# EAGLE design rapidshark-main-breakout-top-mk-1.8 (EAGLE 6.5.0)
AUTHOR: sean@yak.net
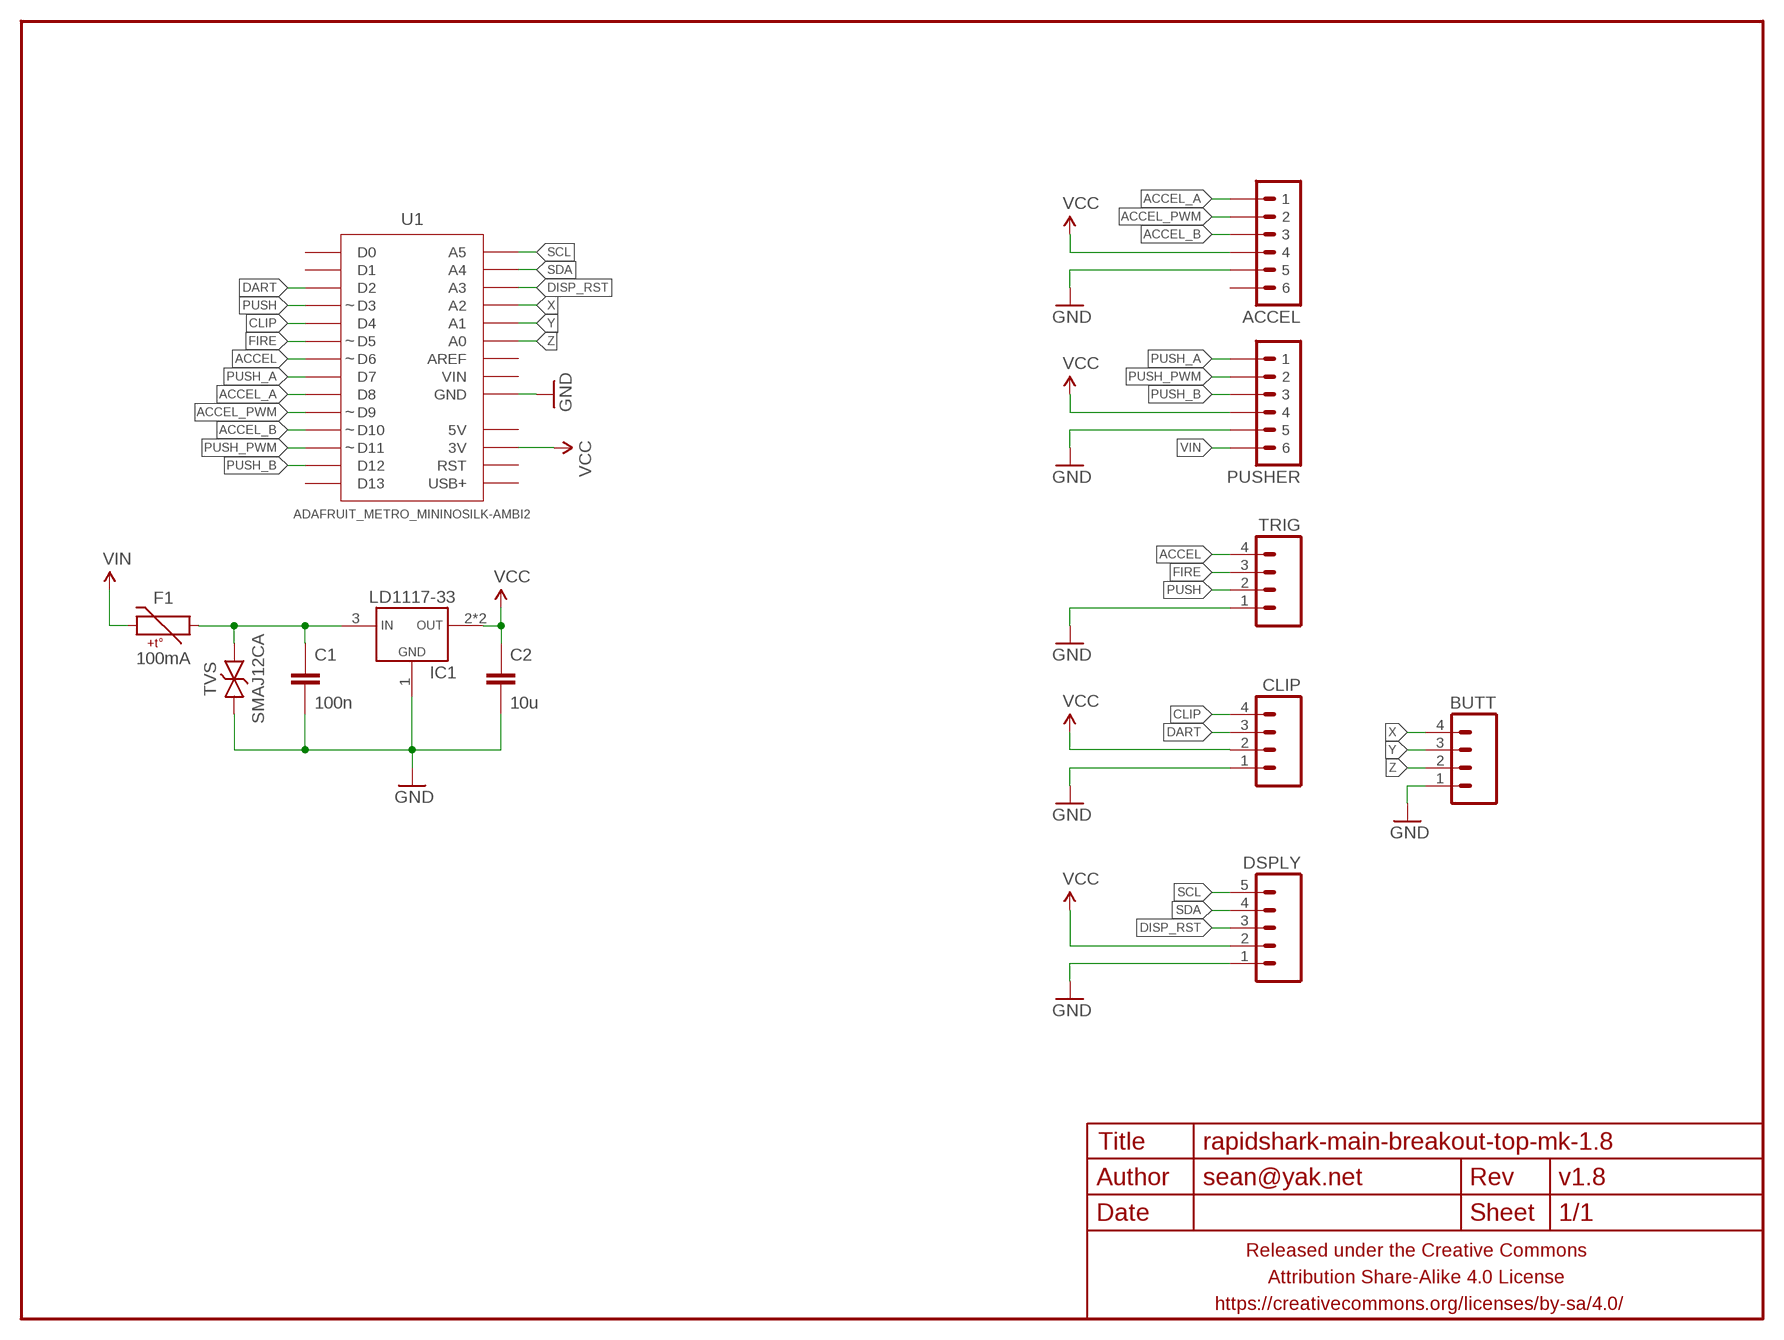
[diagram p0: schematic, sheet 1]

## Parts
ACCEL  M06JST-PH-PTH-VERT  [JST-6-PH-VERT-PTH]
BUTT  M04JST-PTH-VERT  [JST-4-PH-VERT-PTH]
C1  100n  CAPACITOR-CERAMICC0805  [C0805]
C2  10u  CAPACITOR-CERAMICC0805  [C0805]
CLIP  M04JST-PTH-VERT  [JST-4-PH-VERT-PTH]
DSPLY  M05JST-PH-VERT-PTH  [JST-5-PH-VERT-PTH]
F1  100mA  PTCSMD  [PTC-1206]
FRAME1  FRAME-LETTERNO_PACKAGE  [DUMMY]
IC1  LD1117-33  VREG_1117SOT223  [SOT223]
PUSHER  M06JST-PH-PTH-VERT  [JST-6-PH-VERT-PTH]
TRIG  M04JST-PTH-VERT  [JST-4-PH-VERT-PTH]
TVS  SMAJ12CA  TVSSMA  [SMA-DIODE-TVS-BIDIR]
U1  ADAFRUIT_METRO_MININOSILK-AMBI2  [ADAFRUIT_METRO_MINI_BACK]

## Nets
ACCEL: TRIG.4 U1.7(D6)
ACCEL_A: ACCEL.1 U1.9(D8)
ACCEL_B: ACCEL.3 U1.11(D10)
ACCEL_PWM: ACCEL.2 U1.10(D9)
CLIP: CLIP.4 U1.5(D4)
DART: CLIP.3 U1.3(D2)
DISP_RST: DSPLY.3 U1.26(A3)
FIRE: TRIG.3 U1.6(D5)
GND: ACCEL.5 BUTT.1 C1.2 C2.2 CLIP.1 DSPLY.1 IC1.1(GND) PUSHER.5 TRIG.1 TVS.1 U1.19(GND) U1.20(GND)
N$1: C1.1 F1.1 IC1.3(VIN) TVS.2
PUSH: TRIG.2 U1.4(D3)
PUSH_A: PUSHER.1 U1.8(D7)
PUSH_B: PUSHER.3 U1.13(D12)
PUSH_PWM: PUSHER.2 U1.12(D11)
SCL: DSPLY.5 U1.28(A5)
SDA: DSPLY.4 U1.27(A4)
VCC: ACCEL.4 C2.1 CLIP.2 DSPLY.2 IC1.2(VOUT) IC1.4(VOUT) PUSHER.4 U1.17(3V)
VIN: F1.2 PUSHER.6
X: BUTT.4 U1.25(A2)
Y: BUTT.3 U1.24(A1)
Z: BUTT.2 U1.23(A0)
Unconnected: ACCEL.6 U1.1(D0) U1.2(D1) U1.14(D13) U1.15(USB+) U1.16(RST) U1.18(5V) U1.21(VIN) U1.22(AREF)

## Library data of the parts
ACCEL PUSHER = A_butts:M06: Header 6 Standard 6-pin 0.1" header. Use with straight break away headers (SKU : PRT-00116), right angle break away headers (PRT-00553), swiss pins (PRT-00743), machine pins (PRT-00117), and female headers (PRT-00115). Molex polarized connector foot print use with SKU : PRT-08094 with associated crimp pins and housings. NOTES ON THE VARIANTS LOCK and LOCK_LONGPADS... This footprint was designed to help hold the alignment of a through-hole component (i.e. 6-pin header) while soldering it into place. You may notice that each hole has been shifted either up or down by 0.005 of an inch from it's more standard position (which is a perfectly straight line). This slight alteration caused the pins (the squares in the middle) to touch the edges of the holes. Because they are alternating, it causes a "brace" to hold the component in place. 0.005 has proven to be the perfect amount of "off-center" position when using our standard breakaway headers. Although looks a little odd when you look at the bare footprint, once you have a header in there, the alteration is very hard to notice. Also,if you push a header all the way into place, it is covered up entirely on the bottom side. This idea of altering the position of holes to aid alignment will be further integrated into the Sparkfun Library for other footprints. It can help hold any component with 3 or more connection pins.
BUTT CLIP TRIG = A_butts:M04: Header 4 Standard 4-pin 0.1" header. Use with straight break away headers (SKU : PRT-00116), right angle break away headers (PRT-00553), swiss pins (PRT-00743), machine pins (PRT-00117), and female headers (PRT-00115). Molex polarized connector foot print use with SKU : PRT-08231 with associated crimp pins and housings. 1MM SMD Version SKU: PRT-10208
C1 C2 = A_butts:CAPACITOR-CERAMIC: CAPACITOR, European symbol
DSPLY = A_butts:M05: Header 5 Standard 5-pin 0.1" header. Use with straight break away headers (SKU : PRT-00116), right angle break away headers (PRT-00553), swiss pins (PRT-00743), machine pins (PRT-00117), and female headers (PRT-00115). Molex polarized connector foot print use with SKU : PRT-08230 with associated crimp pins and housings.
F1 = A_butts:PTC: Resettable Fuse PTC Resettable Fuse. Spark Fun Electronics SKU : COM-08357; PROD_ID: RES-11150
FRAME1 = A_butts:FRAME-LETTER: Schematic Frame Standard 8.5x11 US Letter frame; DESIGNER: sean@yak.net; VERSION: v1.8
IC1 = A_butts:VREG_1117
TVS = A_butts:TVS: Transient voltage suppressor- prevents ESD on inputs. Ignore package description- MBRA140 is NOT this type of part!!!
U1 = A_butts:ADAFRUIT_METRO_MINI

## Board
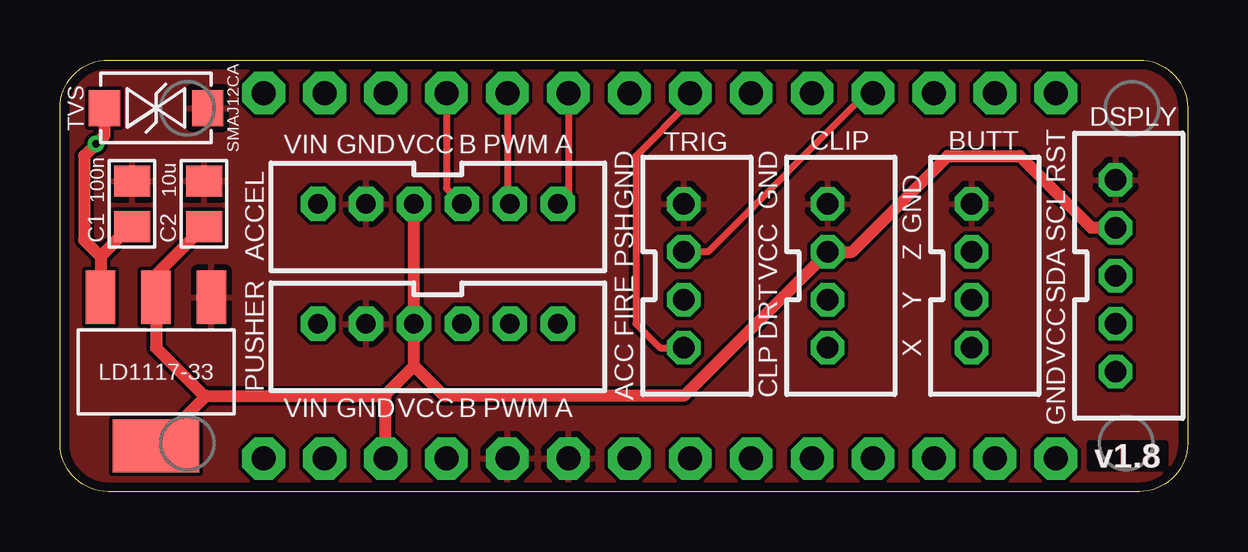
[diagram p1: board, top side]
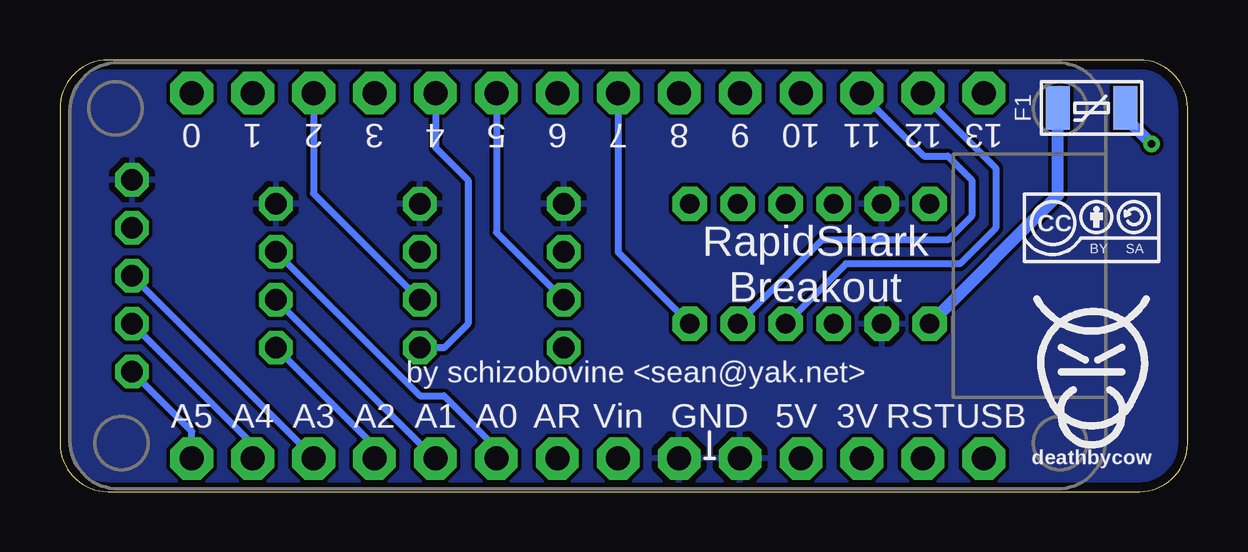
[diagram p2: board, bottom side, seen from below]

Size 47 x 18 mm. Coordinates in mm from the lower left corner, seen from the top.
Outline: 2,18 45,18 arc-90 47,16 47,2 arc-90 45,0 2,0 arc-90 0,2 0,16 arc-90 2,18
Copper layers (1*16): Top 0.0356mm / dielectric 1.5011mm / Bottom 0.0356mm
Design rules "LaenPCBOrder_2": minimum track width 6mil, minimum drill 13mil, track to track 6mil, track to pad 6mil, pad to pad 6mil, via to via 6mil, smd to smd 6mil, copper to edge 15mil, drill to drill 6mil, minimum pad ring 7mil, minimum via ring 7mil, stop-mask expansion 3mil, vias tented up to drill 20mil, thermal gap 10mil

### Footprints (pad centres in the part's own frame; a part is rotated, then mirrored left to right if it is on the bottom)
JST-6-PH-VERT-PTH = drill 0.8 pad 1.422 octagon: 1 -5,0; 2 -3,0; 3 -1,0; 4 1,0; 5 3,0; 6 5,0
JST-4-PH-VERT-PTH = drill 0.9 pad 1.4 octagon: 1 0,0; 2 2,0; 3 4,0; 4 6,0
C0805 = smd 1.3 x 1.5: 1 -0.95,0; 2 0.95,0
JST-5-PH-VERT-PTH = drill 0.9 pad 1.4 octagon: 1 -4,0; 2 -2,0; 3 0,0; 4 2,0; 5 4,0
PTC-1206 = smd 1 x 1.8: 1 -1.4,0; 2 1.4,0
SOT223 = smd 1.219 x 2.235: 1 -2.311,-3.099; 2 0,-3.099; 3 2.311,-3.099 | smd 3.6 x 2.2: 4 0,3.099
SMA-DIODE-TVS-BIDIR = smd 1.3 x 1.5: 1 -2.15,0; 2 2.15,0
ADAFRUIT_METRO_MINI_BACK = drill 1 pad 1.778 octagon: 1 16.51,7.62; 2 13.97,7.62; 3 11.43,7.62; 4 8.89,7.62; 5 6.35,7.62; 6 3.81,7.62; 7 1.27,7.62; 8 -1.27,7.62; 9 -3.81,7.62; 10 -6.35,7.62; 11 -8.89,7.62; 12 -11.43,7.62; 13 -13.97,7.62; 14 -16.51,7.62; 15 -16.51,-7.62; 16 -13.97,-7.62; 17 -11.43,-7.62; 18 -8.89,-7.62; 19 -6.35,-7.62; 20 -3.81,-7.62; 21 -1.27,-7.62; 22 1.27,-7.62; 23 3.81,-7.62; 24 6.35,-7.62; 25 8.89,-7.62; 26 11.43,-7.62; 27 13.97,-7.62; 28 16.51,-7.62

### Placement (x,y rotation side)
ACCEL  15.75,12 180 top
BUTT  38,12 270 top
C1  3,12 90 top
C2  6,12 90 top
CLIP  32,12 270 top
DSPLY  44,9 270 top
F1  4,16 180 bottom
FRAME1  0,0 270 bottom
IC1  4,5 180 top
PUSHER  15.75,7 180 top
TRIG  26,12 270 top
TVS  4,16 180 top
U1  25,9 0 top
U$1  [CC-BY-SA-4.0-NO-URL]  4,11 0 bottom
U$2  [COW_SMALL]  4,5.5 0 bottom

### Tracks (layer width: path | path; a pad name or v marks a point on that pad's centre or on a via)
ACCEL
  Top 0.3: U1.7 26.27,16.27 24,14 24,7 25,6 TRIG.4
ACCEL_A
  Top 0.3: U1.9 21.19,12.44 ACCEL.1
ACCEL_B
  Top 0.3: U1.11 16.11,12.64 ACCEL.3
ACCEL_PWM
  Top 0.3: U1.10 18.65,12.1 ACCEL.2
CLIP
  Bottom 0.3: U1.5 31.35,14.35 30,13 30,7 31,6 CLIP.4
DART
  Bottom 0.3: U1.3 36.43,12.43 CLIP.3
DISP_RST
  Bottom 0.3: U1.26 36.43,1.43 DSPLY.3
FIRE
  Bottom 0.3: U1.6 28.81,10.81 TRIG.3
GND
  pour Top (rank 6): 2,18 45,18 arc-90 47,16 47,2 arc-90 45,0 2,0 arc-90 0,2 0,16 arc-90
  pour Bottom (rank 6): 2,18 45,18 arc-90 47,16 47,2 arc-90 45,0 2,0 arc-90 0,2 0,16 arc-90
N$1  (via drill 0.33)
  Top 0.5: TVS.2 1.85,14.85 v1.5,14.5 1,14 1,10.5 1.69,9.81 | 1.69,9.81 IC1.3 | 1.69,9.81 2.93,11.05 C1.1
  Bottom 0.5: F1.1 2.6,15.6 v1.5,14.5
PUSH
  Top 0.3: U1.4 33.62,16.62 27,10 TRIG.2
PUSH_A
  Bottom 0.3: U1.8 23.73,9.98 PUSHER.1
PUSH_B
  Bottom 0.3: U1.13 11.03,16.53 8,13.5 8,11 9.5,9.5 14.25,9.5 PUSHER.3
PUSH_PWM
  Bottom 0.3: U1.12 13.57,16.57 11,14 10,14 9,13 9,11.5 10,10.5 15.25,10.5 PUSHER.2
SCL
  Bottom 0.3: U1.28 41.51,2.51 DSPLY.5
SDA
  Bottom 0.3: U1.27 38.97,1.97 DSPLY.4
VCC
  Top 0.5: IC1.4 6.05,3.95 | 6.05,3.95 6.1,4 13.5,4 | 13.5,4 14.75,5.25 | 14.75,5.25 PUSHER.4 ACCEL.4 | U1.17 13.57,3.93 13.5,4 | 14.75,5.25 16,4 26,4 CLIP.2 33,10 37,14 40,14 43,11 DSPLY.2 | C2.1 4,9.05 IC1.2 4,6 6.05,3.95
VIN
  Bottom 0.5: PUSHER.6 5.4,12.35 F1.2
X
  Bottom 0.3: U1.25 33.89,1.89 BUTT.4
Y
  Bottom 0.3: U1.24 31.38,1.38 BUTT.3
Z
  Bottom 0.3: BUTT.2 32,4 31,4 28.81,1.81 U1.23

### Text on the board
tPlace: VIN | GND | VCC | B | PWM | A | RST | GND | GND | GND | SCL | PSH | VCC | Z | SDA | FIRE | DRT | Y | X | VCC | ACC | CLP | VIN | GND | VCC | B | PWM | A | GND
bPlace: RapidShark / Breakout | by schizobovine <sean@yak.net>